# EAGLE design mcRelay (EAGLE 7.6.0)
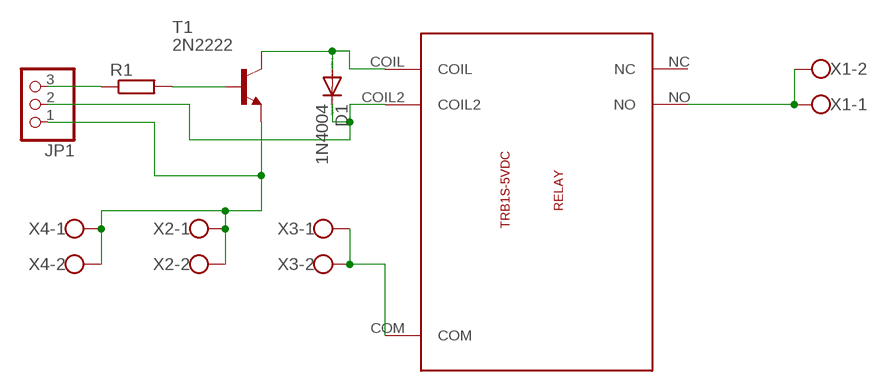
[diagram p0: schematic, sheet 1]

## Parts
D1  1N4004  [DO41-10]
JP1  PINHD-1X3  [1X03]
R1  R-EU_0204/7  [0204/7]
T1  2N2222  [TO18]
U$1  TRB1S-5VDC-RELAY-DEV  [TRB1S-5VDC-RELAY-PAC]
X1  W237-102  [W237-102]
X2  W237-102  [W237-102]
X3  W237-102  [W237-102]
X4  W237-102  [W237-102]

## Nets
N$1: U$1.COM X3.1 X3.2
N$2: JP1.1 T1.1(E) X2.1 X2.2 X4.1 X4.2
N$3: U$1.NO X1.1 X1.2
N$4: JP1.3 R1.1
N$5: R1.2 T1.2(B)
N$8: D1.A T1.3(C) U$1.COIL
N$9: D1.C JP1.2 U$1.COIL2
Unconnected: U$1.NC

## Library data of the parts
D1 = diode:1N4004: DIODE general purpose rectifier, 1 A
JP1 = pinhead:PINHD-1X3: PIN HEADER
R1 = resistor:R-EU_: RESISTOR, European symbol
T1 = transistor:2N2222: NPN TRANSISTOR
U$1 = Dr_Burrows_library:TRB1S-5VDC-RELAY-DEV
X1-X4 = con-wago-500:W237-102: WAGO SCREW CLAMP; MPN: 237-102; OC_FARNELL: unknown; OC_NEWARK: 70K9898

## Board
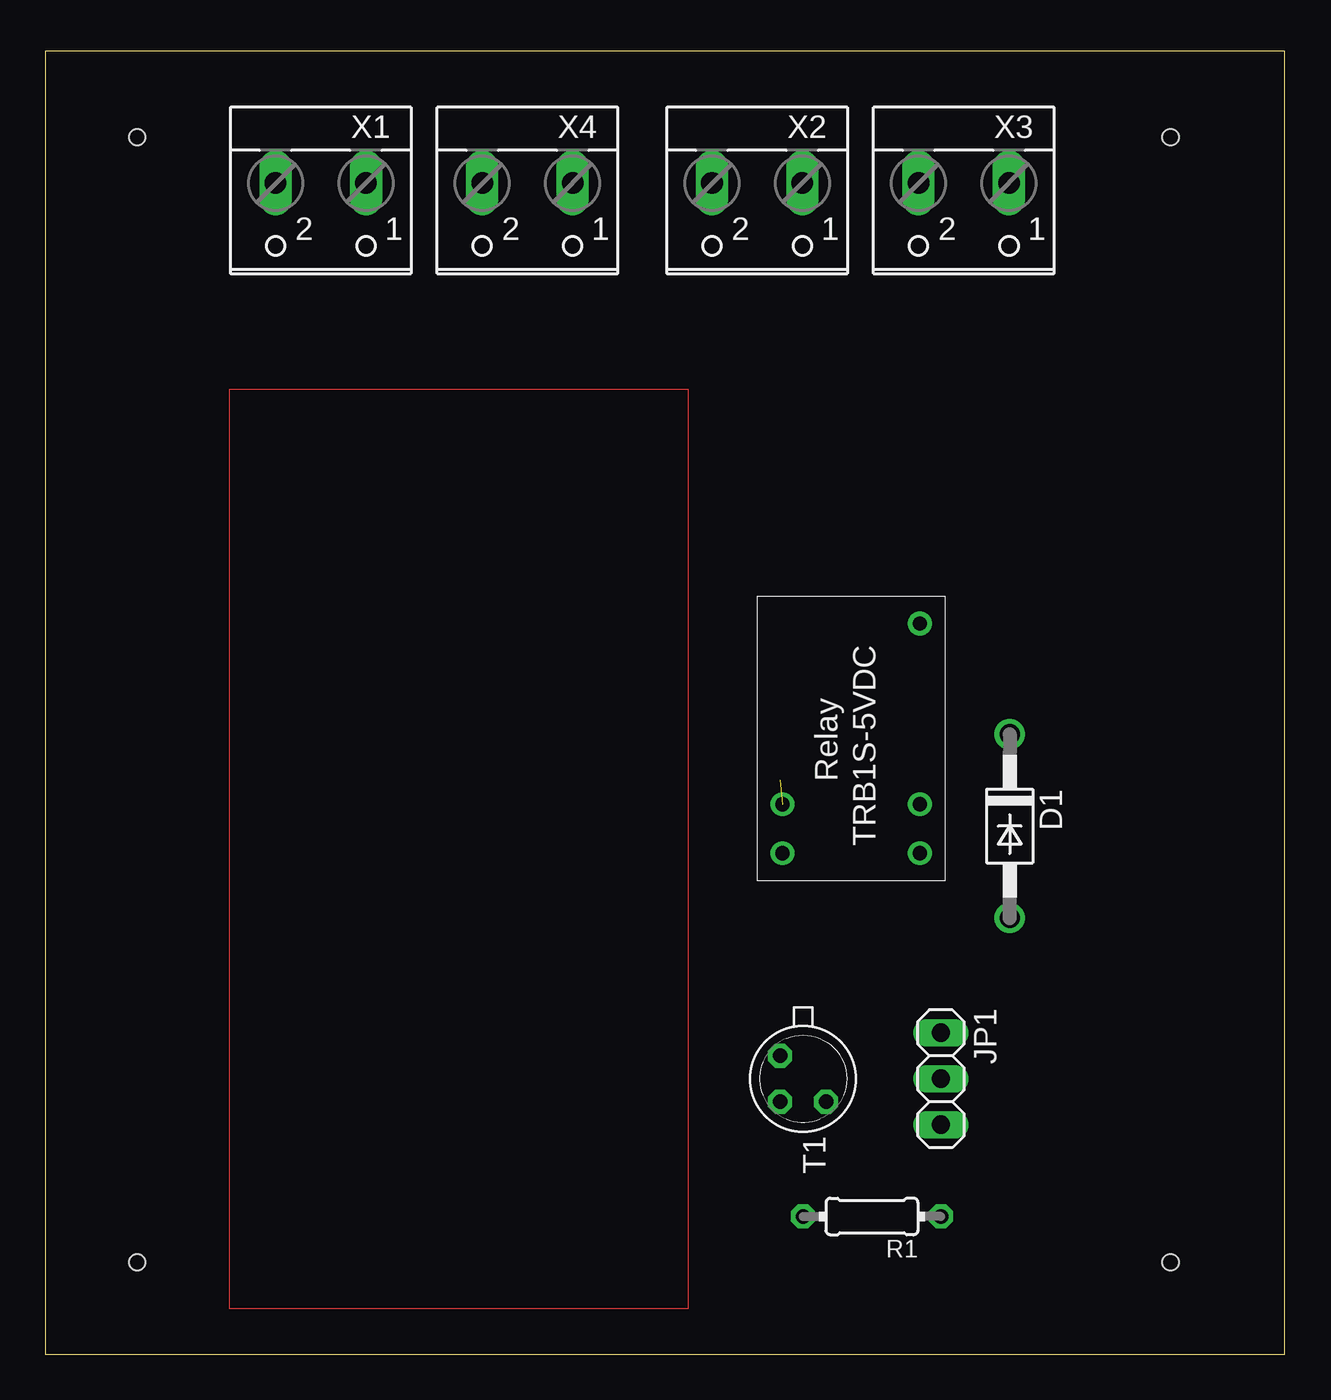
[diagram p1: board, top side]
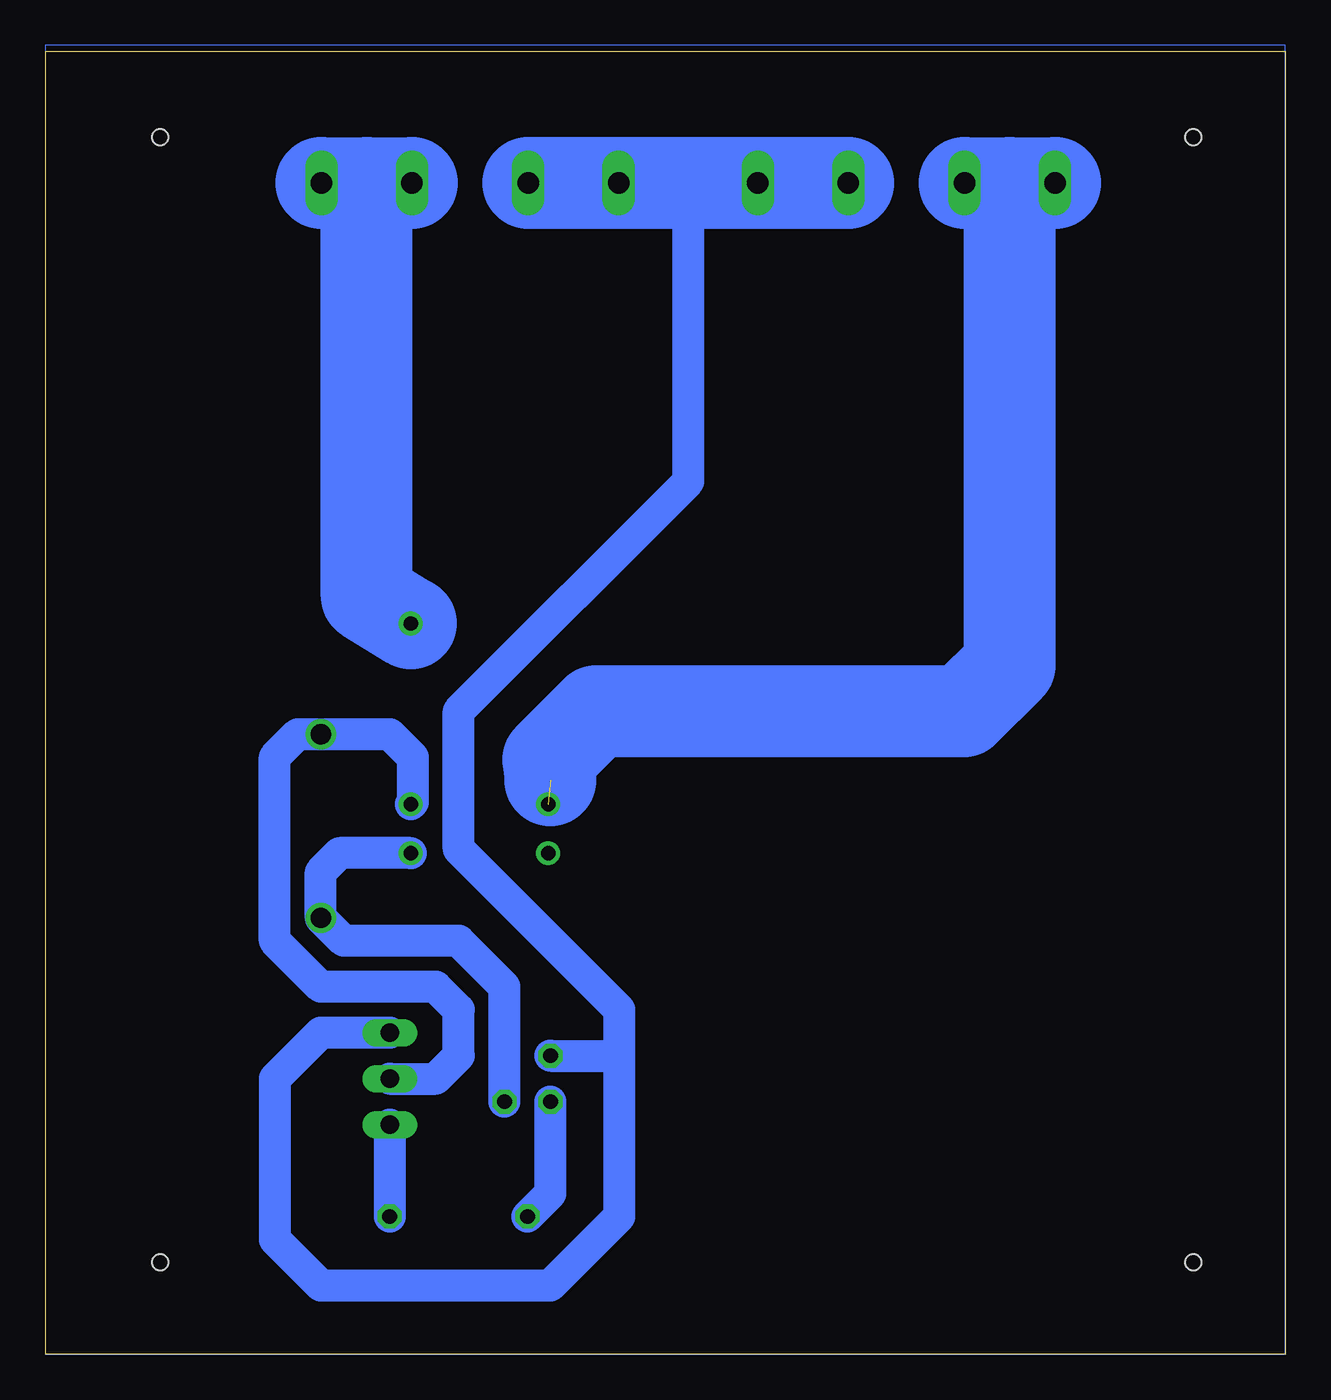
[diagram p2: board, bottom side, seen from below]

Size 68.56 x 72.06 mm. Coordinates in mm from the lower left corner, seen from the top.
Outline: 0,0 68.56,0 68.56,72.06 0,72.06 0,0
Copper layers (1*16): Top 0.035mm / dielectric 1.5mm / Bottom 0.035mm
Design rules "default *": minimum track width 10mil, minimum drill 24mil, track to track 8mil, track to pad 8mil, pad to pad 8mil, via to via 8mil, smd to smd 8mil, copper to edge 40mil, drill to drill 8mil, minimum pad ring 10mil, minimum via ring 8mil, stop-mask expansion 4mil, vias tented up to drill 0mil, thermal gap 10mil
Holes 0.9 mm at 5.08,5.08 62.23,5.08 5.08,67.31 62.23,67.31

### Footprints (pad centres in the part's own frame; a part is rotated, then mirrored left to right if it is on the bottom)
DO41-10 = drill 1.118: A 5.08,0; C -5.08,0
1X03 = drill 1.016 long: 1 -2.54,0; 2 0,0; 3 2.54,0
0204/7 = drill 0.813 octagon: 1 -3.81,0; 2 3.81,0
TO18 = drill 0.813 octagon: 1 -1.27,-1.27; 2 1.27,-1.27; 3 1.27,1.27
TRB1S-5VDC-RELAY-PAC = drill 0.8: COIL 14.2,9; COIL2 11.5,9; COM 1.5,9; NC 14.2,1.4; NO 11.5,1.4
W237-102 = drill 1.194 long: 1 -2.5,-1.27; 2 2.5,-1.27

### Placement (x,y rotation side)
D1  53.34,29.21 270 top
JP1  49.53,15.24 270 top
R1  45.72,7.62 180 top
T1  41.91,15.24 270 top
U$1  39.37,41.91 270 top
X1  15.24,63.5 180 top
X2  39.37,63.5 180 top
X3  50.8,63.5 180 top
X4  26.67,63.5 180 top

### Tracks (layer width: path | path; a pad name or v marks a point on that pad's centre or on a via)
N$1
  Bottom 5.08: X3.1 50.8,64.77 | 50.8,64.77 X3.2 | U$1.COM 50.8,41.91 50.8,64.77
N$2
  Bottom 1.778: JP1.1 53.34,17.78 55.88,15.24 55.88,6.35 53.34,3.81 40.64,3.81 36.83,7.62 36.83,16.51 | 36.83,16.51 36.83,19.05 45.72,27.94 45.72,35.56 33.02,48.26 33.02,64.77 | T1.1 36.83,16.51
  Bottom 5.08: X4.2 X4.1 33.02,64.77 X2.2 X2.1
N$3  (1 unrouted)
  Bottom 5.08: X1.1 15.24,64.77 | 15.24,64.77 X1.2 | 15.24,64.77 15.24,38.1 17.78,35.56 38.1,35.56 40.77,32.89 40.64,31.75
N$4
  Bottom 1.778: JP1.3 R1.1
N$5
  Bottom 1.778: R1.2 40.64,8.89 T1.2
N$6
  Top 0: 10.16,2.54 35.56,2.54 35.56,53.34 10.16,53.34 10.16,2.54
N$7
  Bottom 0: 0,72.39 68.58,72.39 68.58,0 0,0 0,72.39
N$8
  Bottom 1.778: U$1.COIL 52.3,27.71 53.34,26.67 D1.A 52.07,22.86 45.72,22.86 43.18,20.32 T1.3
N$9
  Bottom 1.778: JP1.2 46.99,15.24 45.72,16.51 45.72,19.05 46.99,20.32 53.34,20.32 55.88,22.86 55.88,33.02 54.61,34.29 D1.C 49.53,34.29 48.26,33.02 48.26,30.52 U$1.COIL2